# EasyEDA Pro project 游戏机v1.0.3_2026-06-08.epro

# Schematic M0底板demo
Board Name: 地猛星M0底板demo; Create Date: 2025-10-09; Page Name: P1; Project Name: M0扩展-排母; Schematic Name: M0底板demo; Update Date: 2025-10-16; Company: 嘉立创EDA; Page Size: A4; Version: V1.0
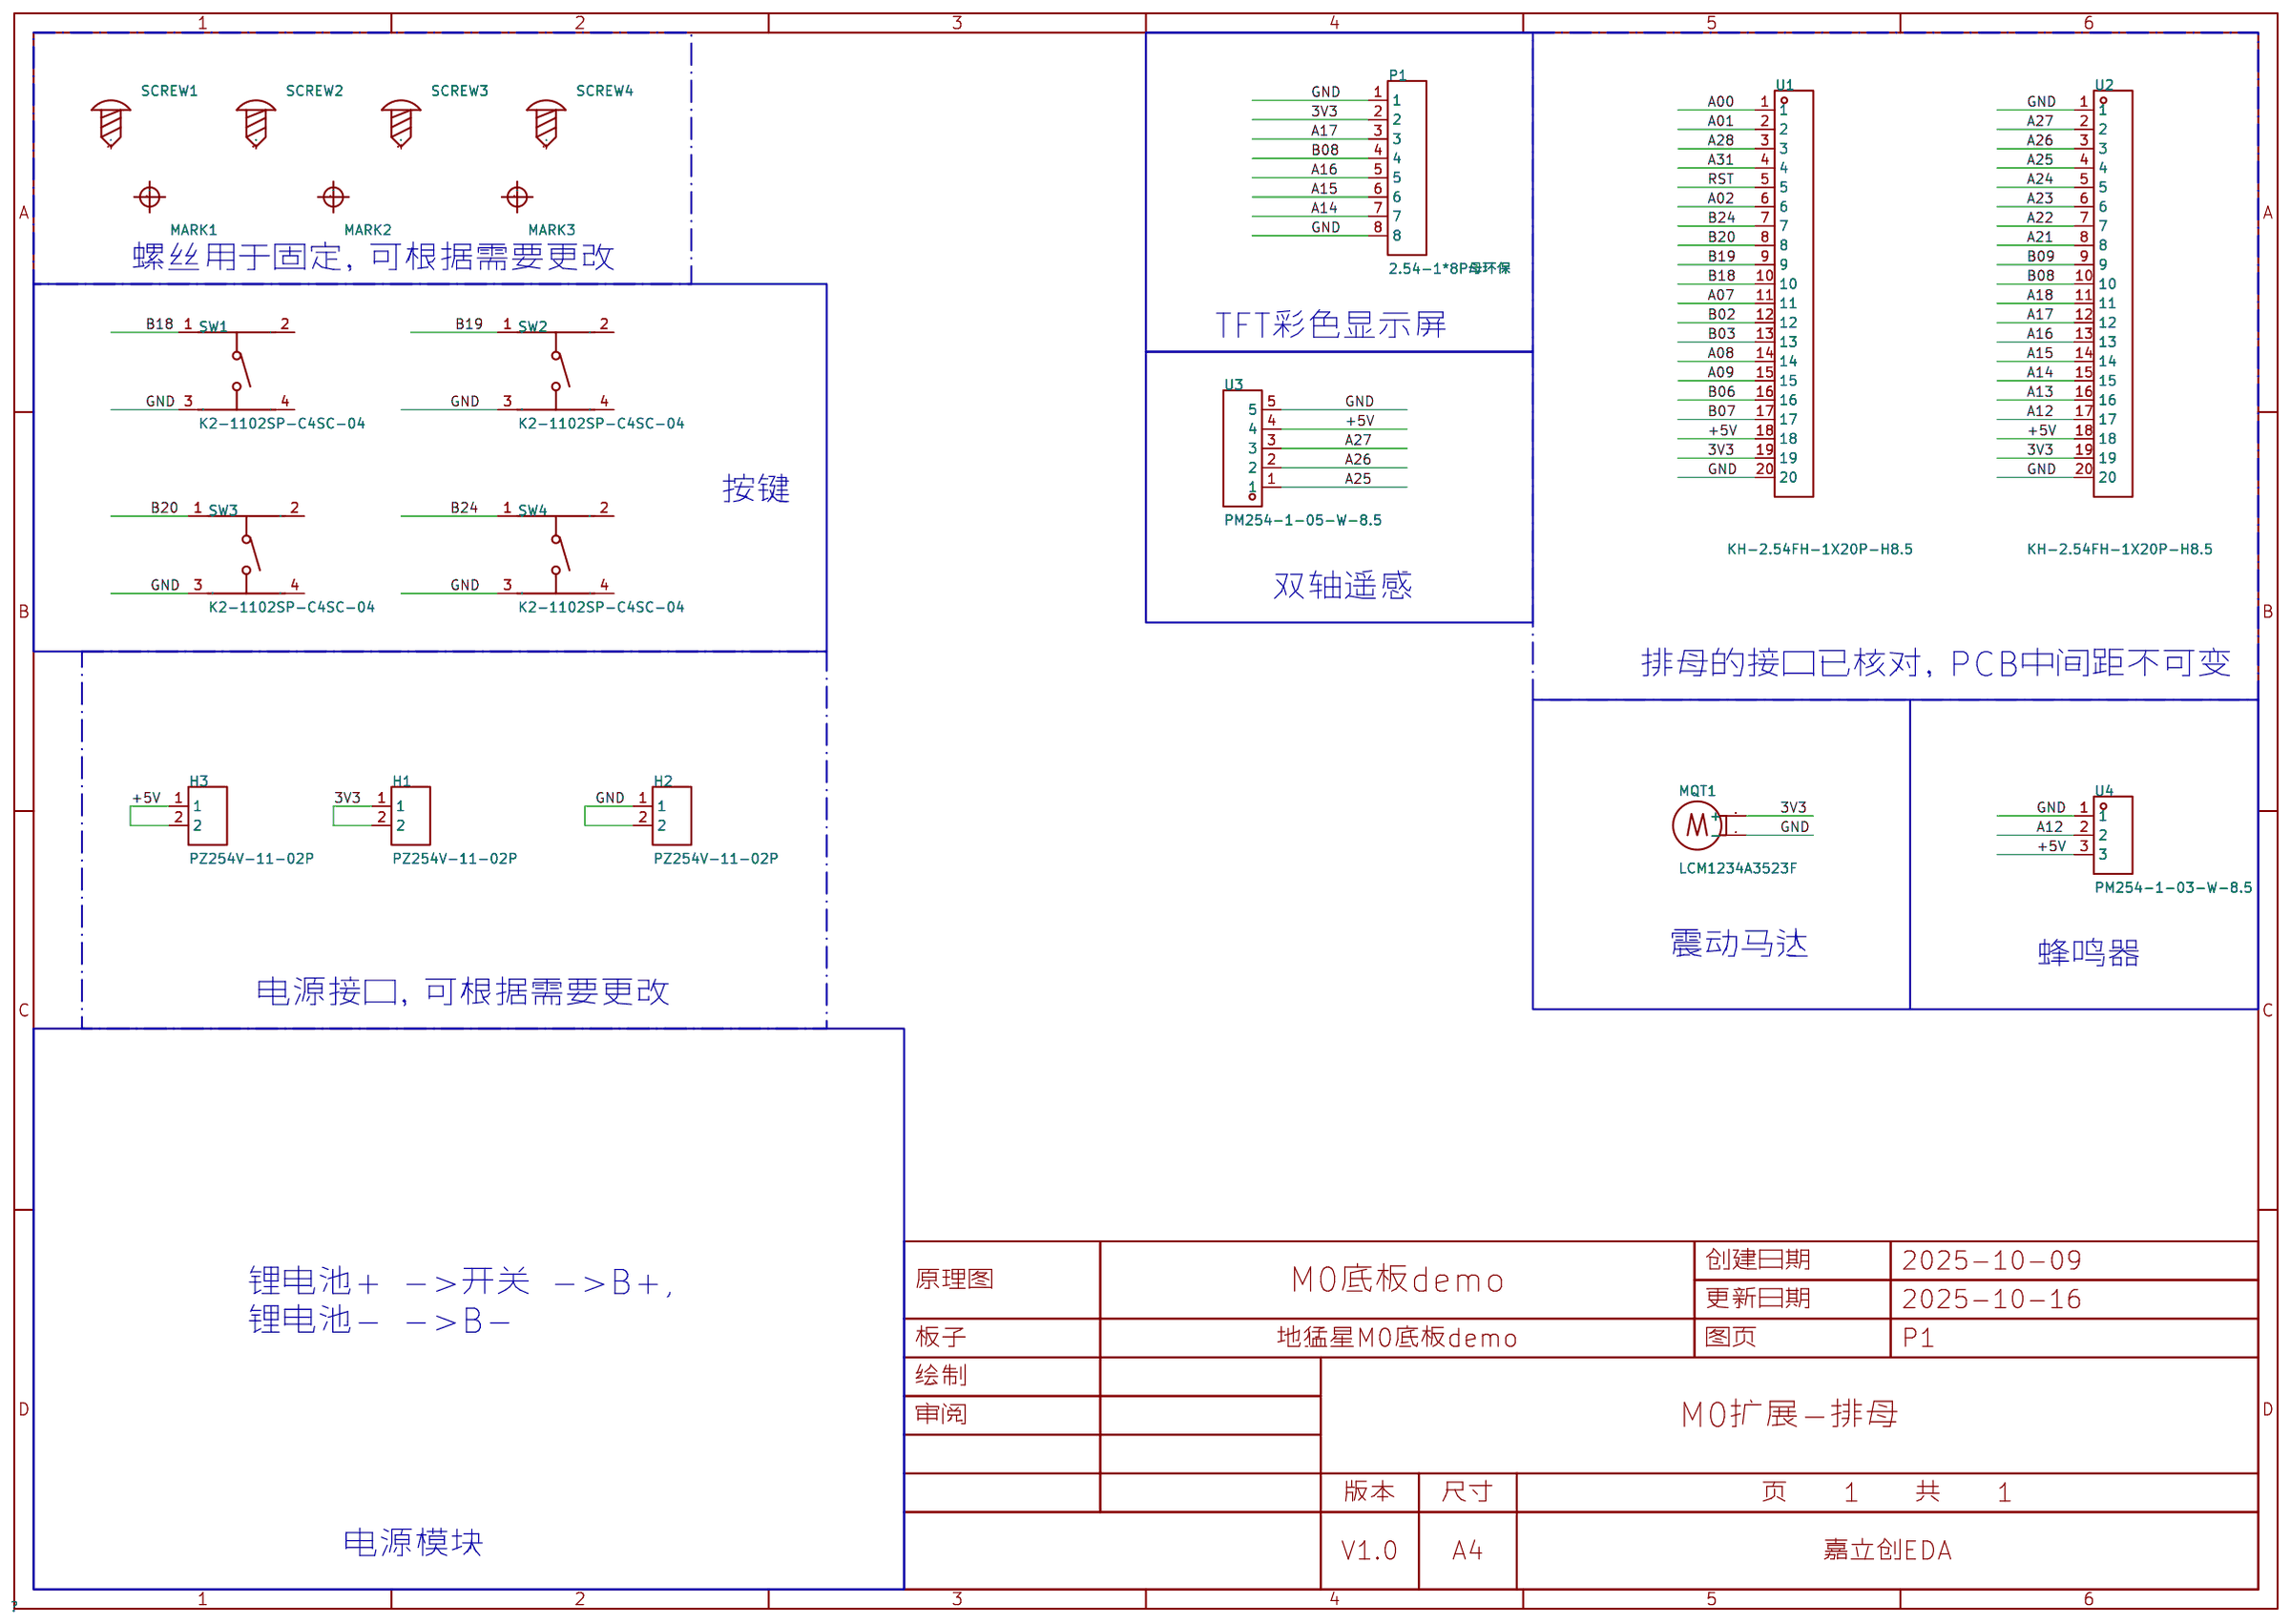
[diagram p0: schematic sheet]

## Parts
H1  PZ254V-11-02P  [HDR-TH_2P-P2.54-V-M]
H2  PZ254V-11-02P  [HDR-TH_2P-P2.54-V-M]
H3  PZ254V-11-02P  [HDR-TH_2P-P2.54-V-M]
MARK1  -  [Mark-Point-1mm]  (no BOM)
MARK2  -  [Mark-Point-1mm]  (no BOM)
MARK3  -  [Mark-Point-1mm]  (no BOM)
MQT1  LCM1234A3523F  [VIBRATING-MOTOR-SMD_WELDING]
P1  2.54-1*8P母环保  [HDR-TH_8P-P2.54-V-F]
SCREW1  -  [M3螺丝]
SCREW2  -  [M3螺丝]
SCREW3  -  [M3螺丝]
SCREW4  -  [M3螺丝]
SW1  K2-1102SP-C4SC-04  [KEY-SMD_4P-L6.0-W6.0-P4.50-LS9.5-BL]
SW2  K2-1102SP-C4SC-04  [KEY-SMD_4P-L6.0-W6.0-P4.50-LS9.5-BL]
SW3  K2-1102SP-C4SC-04  [KEY-SMD_4P-L6.0-W6.0-P4.50-LS9.5-BL]
SW4  K2-1102SP-C4SC-04  [KEY-SMD_4P-L6.0-W6.0-P4.50-LS9.5-BL]
U1  KH-2.54FH-1X20P-H8.5  [HDR-TH_20P-P2.54-V-F-2]
U2  KH-2.54FH-1X20P-H8.5  [HDR-TH_20P-P2.54-V-F-2]
U3  PM254-1-05-W-8.5  [HDR-TH_5P-P2.54-H-F-W10.0-N]
U4  PM254-1-03-W-8.5  [HDR-TH_3P-P2.54-H-F-W10.0-N]

## Library data of the parts
H1-H3 = PZ254V-11-02P: 插针结构:1x2P;间距:2.54mm;行距:-;圆针/方针:方针;安装方式:直插;排数:单排;总PIN位数:2P;额定电流:-;额定电压:-;配合针长度:6mm;塑高:2.5mm;端接针长度:3mm;触头材质:黄铜;触头镀层:-;工作温度:-40℃~+105℃;颜色:黑色;; LCSC Part Name: 1x2P 间距:2.54mm 方针 直插; Supplier Part: C492401; Manufacturer: XFCN(兴飞); Supplier Footprint: 插件,P=2.54mm; JLCPCB Part Class: 扩展库; Datasheet: https://item.szlcsc.com/datasheet/PZ254V-11-02P/502957.html; Supplier: LCSC; Pin Structure: 1x2P; Pitch: 2.54mm; Circluar Pins/Square Pins: 方针; Mounting Type: 直插; Number of Rows: 单排; Number of Pins: 2P; Length of Mating Pin: 6mm; Insulation Height: 2.5mm; Length of End Connection Pin: 3mm; Contact Material: 黄铜; Operating Temperature: -40℃~+105℃; Color: 黑色
MARK1-MARK3 = Mark-Point: Mark点
MQT1 = LCM1234A3523F: 类型:扁平振动马达;额定电压:3.7V;额定转速:11000rpm;旋转方向:CW；CCW;; LCSC Part Name: 扁平1234 高寿命马达-侧边出线款; Supplier Part: C7424783; Manufacturer: LEADER(立得); JLCPCB Part Class: Extended Part; Datasheet: https://item.szlcsc.com/datasheet/LCM1234A3523F/8412375.html; Supplier: LCSC; Type: 扁平振动马达; Voltage Rating: 3.7V; Current Rating: 100mA; Rated Speed: 11000rpm; Operating Temperature: -20℃~+70℃; Sense Of Rotation: CW；CCW; Mounting Type: 引线; Diameter (φD): 11mm
P1 = 2.54-1*8P母环保: 插孔结构:1x8P;间距:2.54mm;行距:-;圆孔/方孔:方孔;安装方式:直插;排数:单排;总孔位数:8P;额定电流:3A;插孔方向:顶部;塑高:8.5mm;触头材质:黄铜;触头镀层:金;工作温度:-55℃~+105℃;; LCSC Part Name: 1x8P 间距:2.54mm 直插; Supplier Part: C27438; Manufacturer: BOOMELE(博穆精密); Supplier Footprint: 插件,P=2.54mm; JLCPCB Part Class: Extended Part; Datasheet: https://item.szlcsc.com/datasheet/2.54-1*8P%25E6%25AF%258D%25E7%258E%25AF%25E4%25BF%259D/28187.html; Supplier: LCSC; Holes Structure: 1x8P; Pitch: 2.54mm; Circular Hole / Square Hole: 方孔; Mounting Type: 直插; Number of Rows: 单排; Number of Positions: 8P; Current Rating: 3A; Holes Direction: 顶部; Insulation Height: 8.5mm; Contact Material: 黄铜; Contact Plating: 金; Operating Temperature: -55℃~+105℃; PIN Length: 3.2mm
SCREW1-SCREW4 = M3螺丝: Supplier Footprint: 插件
SW1-SW4 = K2-1102SP-C4SC-04: 电路结构:单刀单掷;按钮形状:圆形按钮;作用力:2.5N;安装方式:立贴;开关长度:6mm;开关宽度:6mm;开关高度:5mm;触点电流:50mA;额定电压:12V;带灯:-;工作寿命:10万次;; LCSC Part Name: K2-1102SP-C4SC-04 贴片; Supplier Part: C127509; Manufacturer: 韩国韩荣; Supplier Footprint: SMD-4P,6x6mm; JLCPCB Part Class: Extended Part; Datasheet: https://item.szlcsc.com/datasheet/K2-1102SP-C4SC-04/138792.html; Supplier: LCSC; Circuit: 单刀单掷; Actuator Style: 圆形按钮; Operating Force: 2.5N; Mounting Type: 立贴; Length: 6mm; Width: 6mm; Switch Height: 5mm; Contact Current: 50mA; Voltage Rating: 12V; Life: 10万次; Operating Temperature: -25℃~+85℃
U1 U2 = KH-2.54FH-1X20P-H8.5: 插孔结构:1x20P;间距:2.54mm;行距:-;圆孔/方孔:方孔;安装方式:直插;排数:单排;总孔位数:20P;额定电流:3A;额定电压:-;插孔方向:顶部;塑高:8.5mm;工作温度:-40℃~+105℃;; LCSC Part Name: 间距:2.54mm 1x20P 直插; Supplier Part: C2905423; Manufacturer: kinghelm(金航标); Supplier Footprint: 插件,P=2.54mm; JLCPCB Part Class: 扩展库; Datasheet: https://item.szlcsc.com/datasheet/KH-2.54FH-1X20P-H8.5/3175197.html; Supplier: LCSC; Holes Structure: 1x20P; Pitch: 2.54mm; Circular Hole / Square Hole: 方孔; Mounting Type: 直插; Number of Rows: 单排; Number of Positions: 20P; Current Rating: 3A; Holes Direction: 顶部; Insulation Height: 8.5mm; Operating Temperature: -40℃~+105℃
U3 = PM254-1-05-W-8.5: 插孔结构:1x5P;间距:2.54mm;行距:-;圆孔/方孔:方孔;安装方式:弯插;排数:单排;总孔位数:5P;额定电流:3A;额定电压:-;插孔方向:侧面;塑高:8.5mm;触头材质:铜合金;工作温度:-40℃~+105℃;; LCSC Part Name: 1x5P 间距:2.54mm 弯插; Supplier Part: C2897387; Manufacturer: HCTL(华灿天禄); Supplier Footprint: 弯插,P=2.54mm; JLCPCB Part Class: Extended Part; Datasheet: https://item.szlcsc.com/datasheet/PM254-1-05-W-8.5/3142392.html; Supplier: LCSC; Holes Structure: 1x5P; Pitch: 2.54mm; Circular Hole / Square Hole: 方孔; Mounting Type: 弯插; Number of Rows: 单排; Number of Positions: 5P; Current Rating: 3A; Holes Direction: 侧面; Insulation Height: 8.5mm; Contact Material: 铜合金; Operating Temperature: -40℃~+105℃
U4 = PM254-1-03-W-8.5: 插孔结构:1x3P;间距:2.54mm;行距:-;圆孔/方孔:方孔;安装方式:弯插;排数:单排;总孔位数:3P;额定电流:3A;额定电压:-;插孔方向:侧面;塑高:8.5mm;触头材质:铜合金;工作温度:-40℃~+105℃;; LCSC Part Name: 1x3P 间距:2.54mm 弯插; Supplier Part: C2897385; Manufacturer: HCTL(华灿天禄); Supplier Footprint: 弯插,P=2.54mm; JLCPCB Part Class: Extended Part; Datasheet: https://item.szlcsc.com/datasheet/PM254-1-03-W-8.5/3142390.html; Supplier: LCSC; Holes Structure: 1x3P; Pitch: 2.54mm; Circular Hole / Square Hole: 方孔; Mounting Type: 弯插; Number of Rows: 单排; Number of Positions: 3P; Current Rating: 3A; Holes Direction: 侧面; Insulation Height: 8.5mm; Contact Material: 铜合金; Operating Temperature: -40℃~+105℃

## Nets
3V3: H1.1 H1.2 MQT1.2(+) P1.2 U1.19 U2.19
+5V: H3.1 H3.2 U1.18 U2.18 U3.4 U4.3
GND: H2.1 H2.2 MQT1.1(-) P1.1 P1.8 SW1.3 SW2.3 SW3.3 SW4.3 U1.20 U2.1 U2.20 U3.5 U4.1
A00: U1.1
A01: U1.2
A02: U1.6
A07: U1.11
A08: U1.14
A09: U1.15
A12: U2.17 U4.2
A13: U2.16
A14: P1.7 U2.15
A15: P1.6 U2.14
A16: P1.5 U2.13
A17: P1.3 U2.12
A18: U2.11
A21: U2.8
A22: U2.7
A23: U2.6
A24: U2.5
A25: U2.4 U3.1
A26: U2.3 U3.2
A27: U2.2 U3.3
A28: U1.3
A31: U1.4
B02: U1.12
B03: U1.13
B06: U1.16
B07: U1.17
B08: P1.4 U2.10
B09: U2.9
B18: SW1.1 U1.10
B19: SW2.1 U1.9
B20: SW3.1 U1.8
B24: SW4.1 U1.7
RST: U1.5

Not connected (* = marked no-connect by the designer): MARK1 1; MARK2 1; MARK3 1; SCREW1 1; SCREW2 1; SCREW3 1; SCREW4 1; SW1 2 4; SW2 2 4; SW3 2 4; SW4 2 4

## Notes on the sheet
- 螺丝用于固定，可根据需要更改
- TFT彩色显示屏
- 按键
- 双轴遥感
- 排母的接口已核对，PCB中间距不可变
- 震动马达
- 蜂鸣器
- 电源接口，可根据需要更改
- 锂电池+ ->开关 ->B+,
  锂电池- ->B-
- 电源模块

# Board PCB1
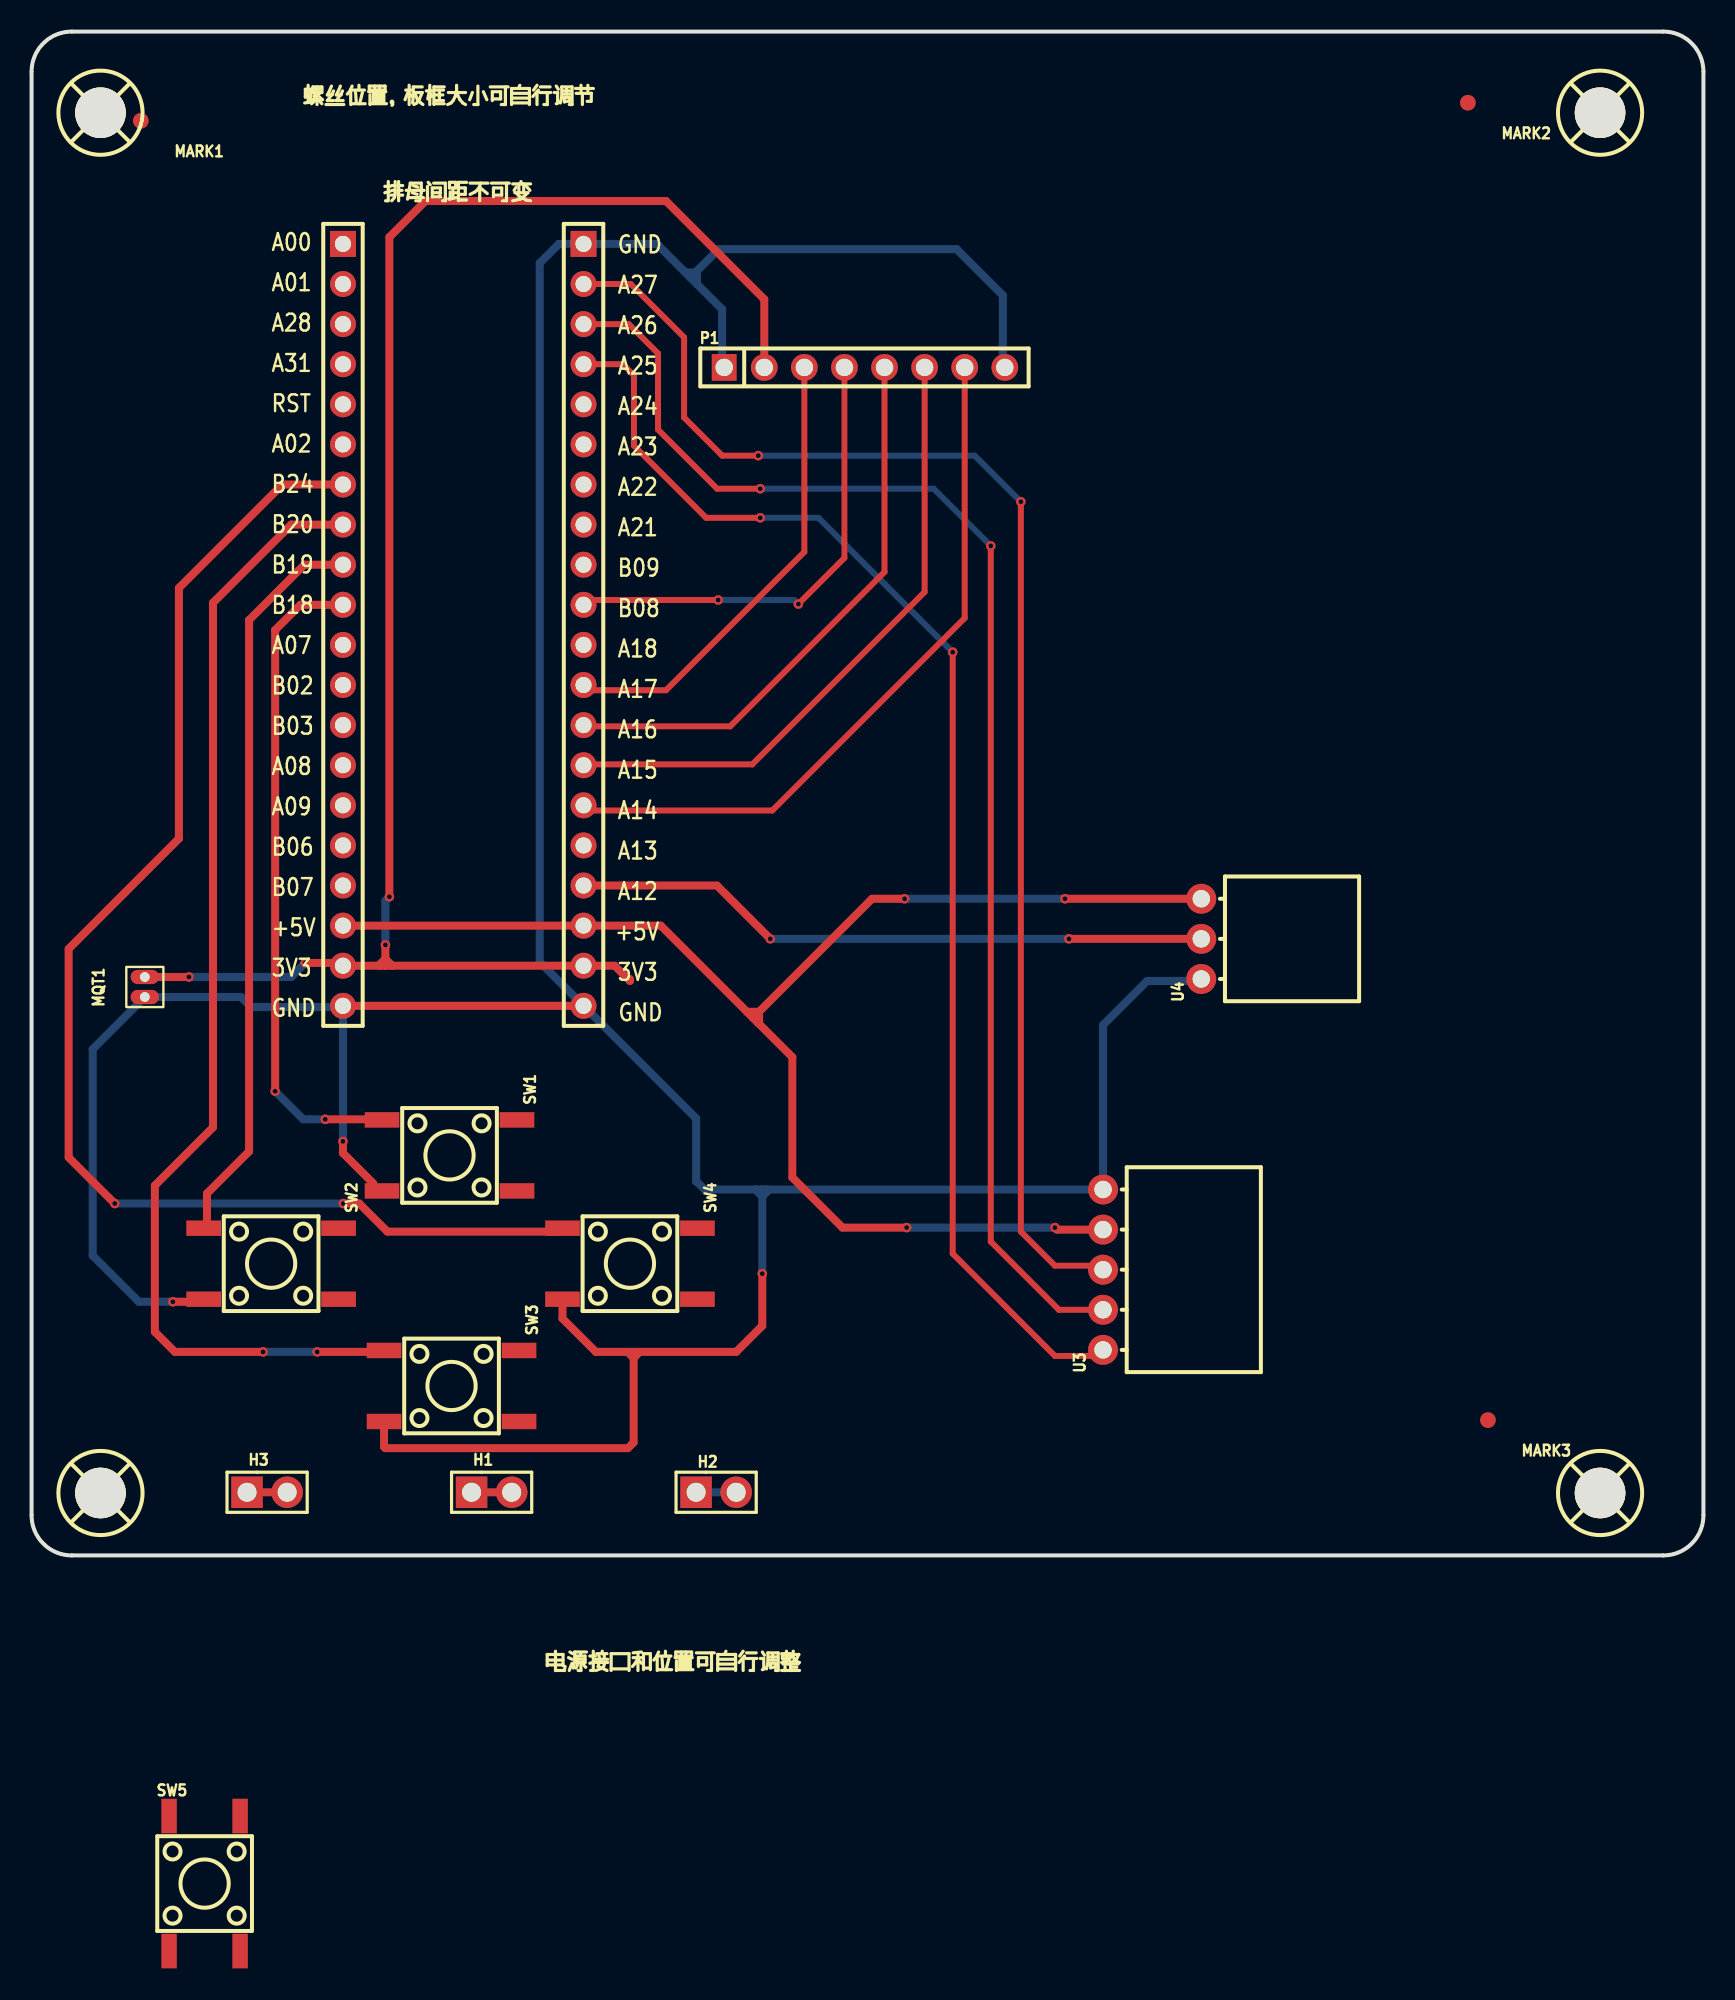
[diagram p1: board, top side]
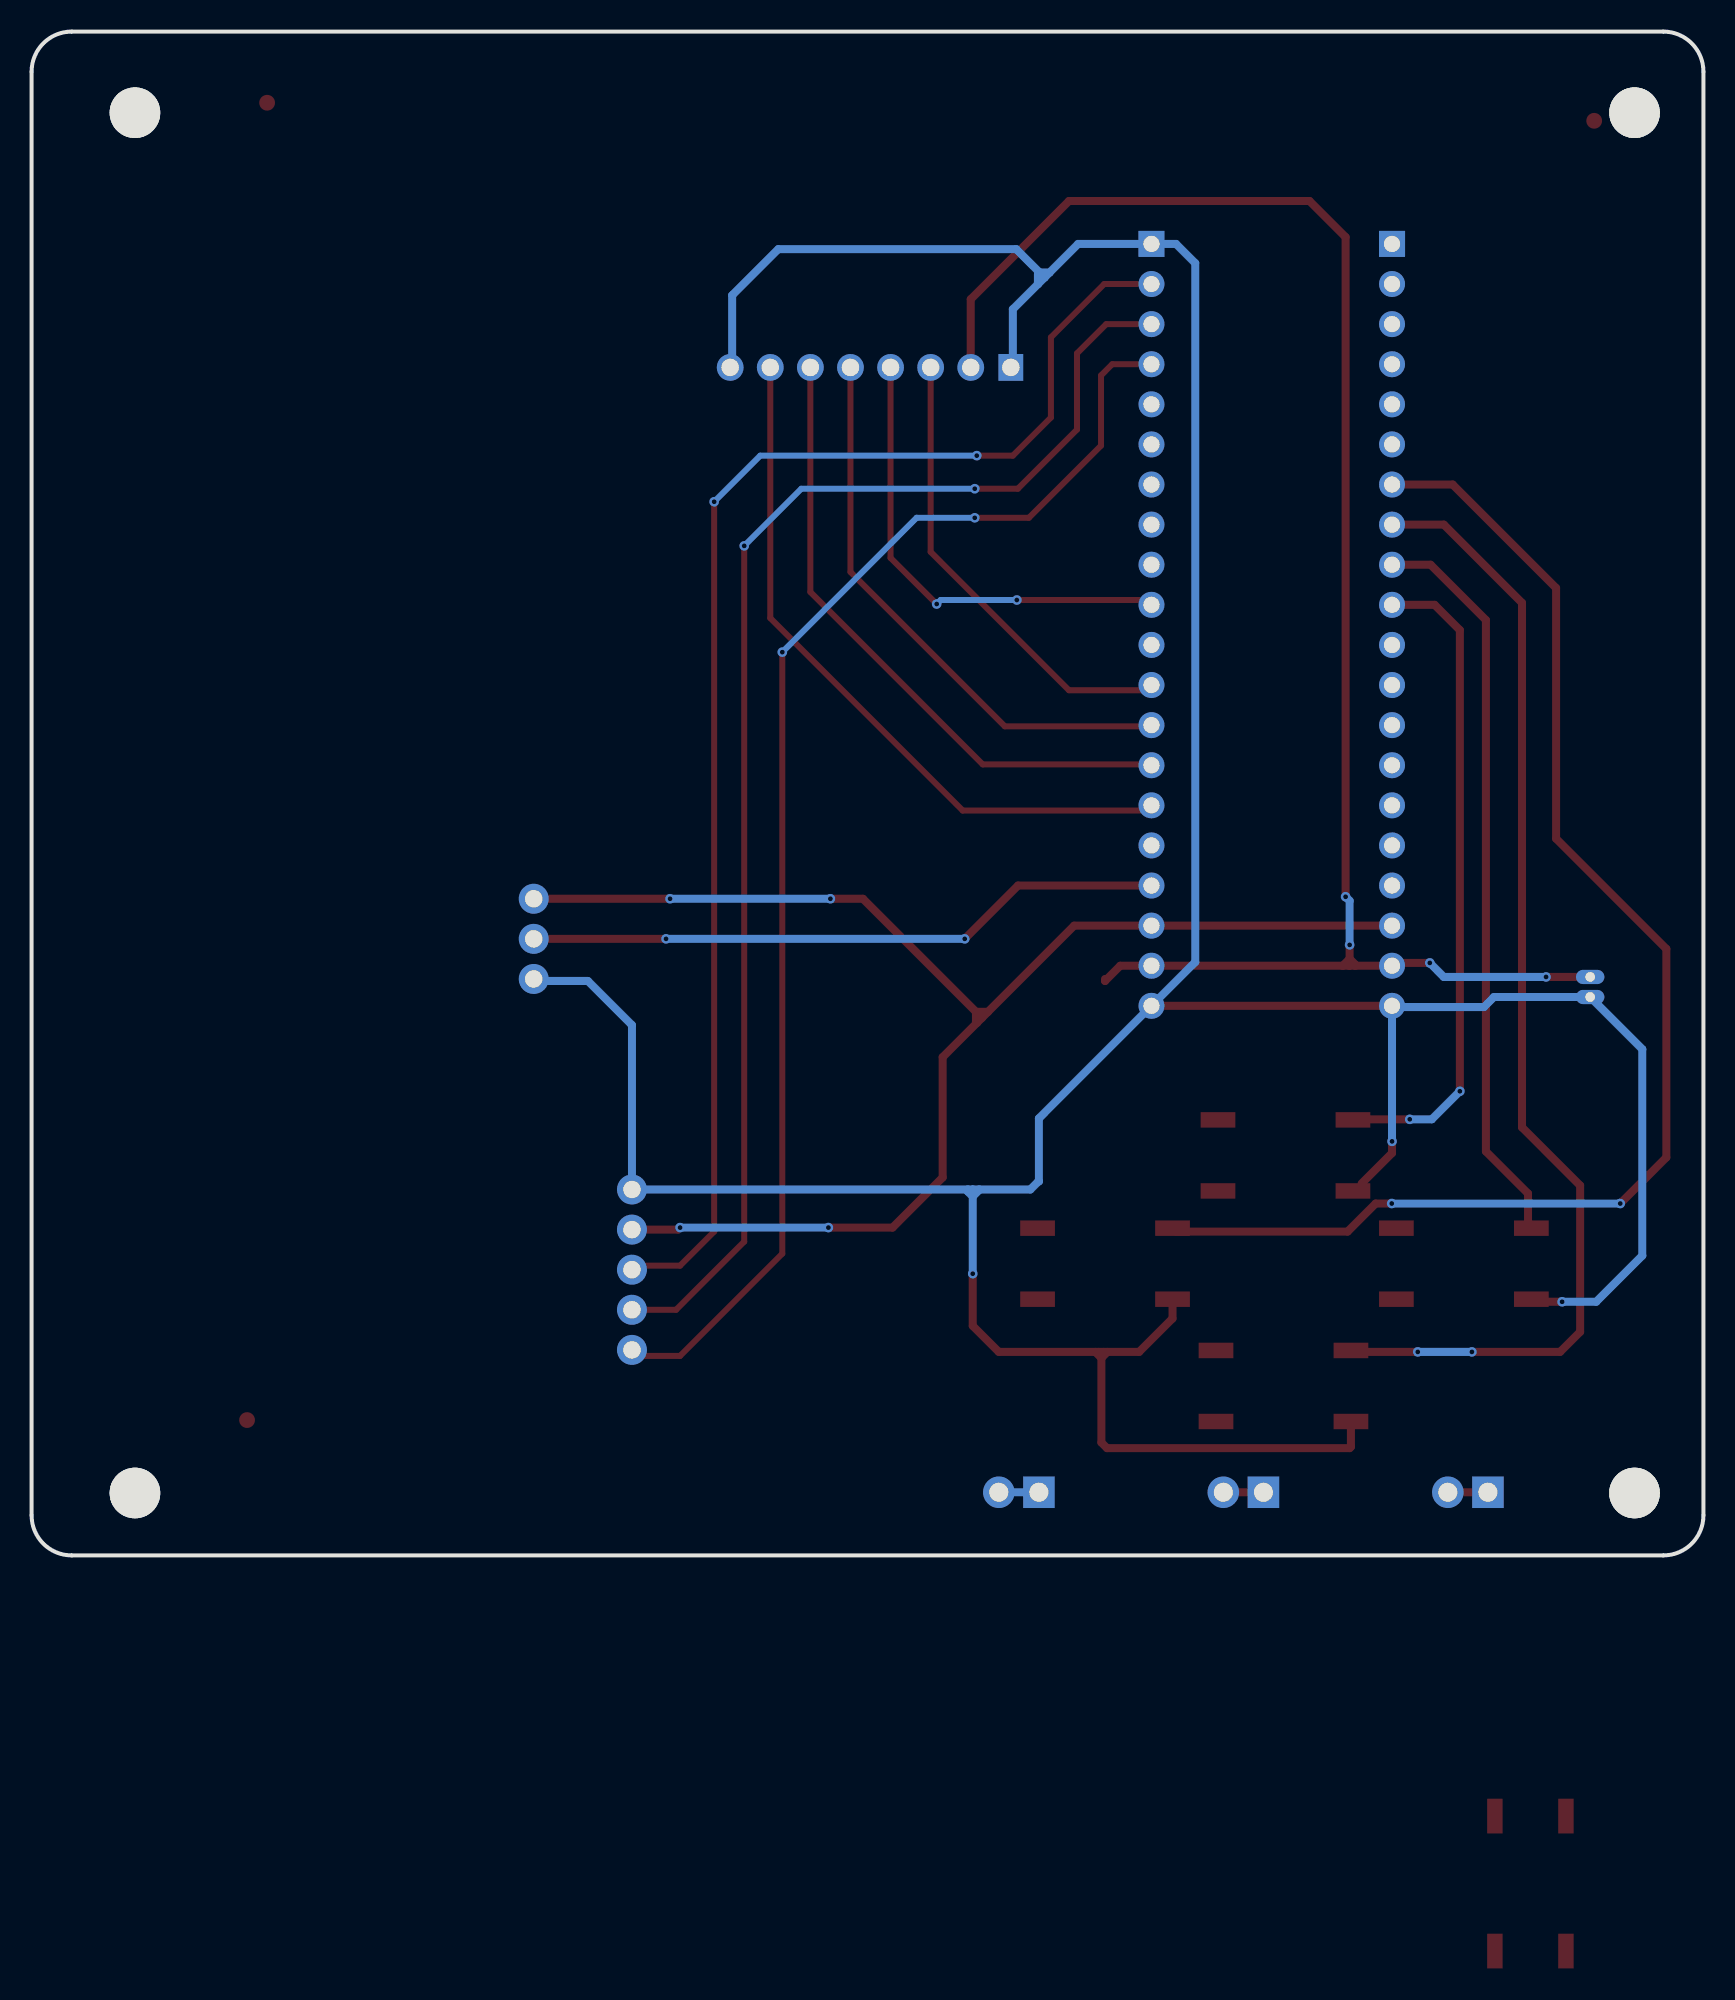
[diagram p2: board, bottom side, seen from below]

Outline 105.92 x 96.52 mm; copper layers: Top Layer, Bottom Layer. Coordinates in mm from the lower left corner of the outline.
Outline path: 0,93.98 arc(0.74,95.78) 2.54,96.52 103.38,96.52 arc(105.17,95.78) 105.92,93.98 105.92,2.54 arc(105.17,0.74) 103.38,0 2.54,0 arc(0.74,0.74) 0,2.54 0,93.98
Stack: Top Layer 0.035mm / Dielectric1 1.51mm FR4 er 4.5 / Bottom Layer 0.035mm

## Design rules (mm)
spacing copperThickness1oz (default): track to track 0.102, other pairs 0.152 to 0.3
spacing copperThickness2oz: track to track 0.203, other pairs 0.152 to 0.3
spacing Plane_innerPlane: track to track 0.102, other pairs 0.152 to 0.3
spacing Copper_copperRegion: track to track 0.102, other pairs 0.152 to 0.3
track width copperThickness1oz (default): min 0.127, default 0.254, max 2.54
track width copperThickness2oz: min 0.203, default 0.254, max 2.54
differential pair differentialPair (default): width min 0.127, default 0.254, max 2.54; gap min 0.152, default 0.152

## Placement (name value [footprint] x y rotation side)
H1  PZ254V-11-02P  [HDR-TH_2P-P2.54-V-M]  29.15 4 0 top
H2  PZ254V-11-02P  [HDR-TH_2P-P2.54-V-M]  43.37 4 0 top
H3  PZ254V-11-02P  [HDR-TH_2P-P2.54-V-M]  14.92 4 0 top
MARK1  -  [Mark-Point-1mm]  9.46 90.87 0 top
MARK2  -  [Mark-Point-1mm]  93.54 92.01 0 top
MARK3  -  [Mark-Point-1mm]  94.81 8.57 0 top
MQT1  LCM1234A3523F  [VIBRATING-MOTOR-SMD_WELDING]  7.18 36 90 top
P1  2.54-1*8P母环保  [HDR-TH_8P-P2.54-V-F]  52.77 75.25 0 top
SCREW1  -  [M3螺丝]  4.37 91.38 0 top
SCREW2  -  [M3螺丝]  99.37 91.38 0 top
SCREW3  -  [M3螺丝]  4.37 3.95 0 top
SCREW4  -  [M3螺丝]  99.37 3.95 0 top
SW1  K2-1102SP-C4SC-04  [KEY-SMD_4P-L6.0-W6.0-P4.50-LS9.5-BL]  26.48 25.34 270 top
SW2  K2-1102SP-C4SC-04  [KEY-SMD_4P-L6.0-W6.0-P4.50-LS9.5-BL]  15.18 18.48 270 top
SW3  K2-1102SP-C4SC-04  [KEY-SMD_4P-L6.0-W6.0-P4.50-LS9.5-BL]  26.61 10.73 270 top
SW4  K2-1102SP-C4SC-04  [KEY-SMD_4P-L6.0-W6.0-P4.50-LS9.5-BL]  37.91 18.48 270 top
SW5  K2-1102SP-C4SC-04  [KEY-SMD_4P-L6.0-W6.0-P4.50-LS9.5-BL]  10.96 -20.79 0 top
U1  KH-2.54FH-1X20P-H8.5  [HDR-TH_20P-P2.54-V-F-2]  19.73 58.94 270 top
U2  KH-2.54FH-1X20P-H8.5  [HDR-TH_20P-P2.54-V-F-2]  34.97 58.94 270 top
U3  PM254-1-05-W-8.5  [HDR-TH_5P-P2.54-H-F-W10.0-N]  67.88 18.1 90 top
U4  PM254-1-03-W-8.5  [HDR-TH_3P-P2.54-H-F-W10.0-N]  74.1 39.05 90 top

## Footprints (pads in the part's own frame, mm; a bottom-side part is the same pattern mirrored in y, then rotated)
HDR-TH_2P-P2.54-V-M
  rect 2x2 hole 1.2: 1(-1.27,0)
  round 2 hole 1.2: 2(1.27,0)
HDR-TH_3P-P2.54-H-F-W10.0-N
  round 1.9 hole 1.1: 1(-2.54,0) 2(0,0) 3(2.54,0)
HDR-TH_5P-P2.54-H-F-W10.0-N
  round 1.9 hole 1.1: 1(-5.08,0) 2(-2.54,0) 3(0,0) 4(2.54,0) 5(5.08,0)
HDR-TH_8P-P2.54-V-F
  rect 1.575x1.7 hole 1.1: 1(-8.89,0)
  round 1.7 hole 1.1: 2(-6.35,0) 3(-3.81,0) 4(-1.27,0) 5(1.27,0) 6(3.81,0) 7(6.35,0) 8(8.89,0)
HDR-TH_20P-P2.54-V-F-2
  rect 1.65x1.65 hole 1.02: 1(-24.13,0)
  round 1.65 hole 1.02: 2(-21.59,0) 3(-19.05,0) 4(-16.51,0) 5(-13.97,0) 6(-11.43,0) 7(-8.89,0) 8(-6.35,0) 9(-3.81,0) 10(-1.27,0) 11(1.27,0) 12(3.81,0) 13(6.35,0) 14(8.89,0) 15(11.43,0) 16(13.97,0) 17(16.51,0) 18(19.05,0) 19(21.59,0) 20(24.13,0)
KEY-SMD_4P-L6.0-W6.0-P4.50-LS9.5-BL
  rect 0.98x2.2 smd: 1(-2.25,-4.275) 2(-2.25,4.275) 3(2.25,-4.275) 4(2.25,4.275)
M3螺丝
  round 3.2 hole 3.2: 1(0,0)
Mark-Point-1mm
  round 1 smd: 1(-2.54,0)
VIBRATING-MOTOR-SMD_WELDING
  oval 0.9x1.8 hole 0.61: 1(-0.635,0) 2(0.635,0)

## Nets
As in the schematic, except:
+5V: H3.1 H3.2 SW5.3 U1.18 U2.18 U3.4 U4.3

Pads without a net: MARK1 1; MARK2 1; MARK3 1; SCREW1 1; SCREW2 1; SCREW3 1; SCREW4 1; SW1 2 4; SW2 2 4; SW3 2 4; SW4 2 4; SW5 2 4

## Via types
v1: diameter 0.61, hole 0.305, Top Layer to Bottom Layer, 27 vias

## Routing (per net, layer and track width the routed paths; a pad name or vN(x,y) marks a point on that pad's centre or on a via; arc(x,y) is an arc through that point)
3V3: length 113.3
  Top Layer w0.508: 22.06,37.35 U1.19 19.55,37.53 v1(17.34,37.53) ; 22.06,37.35 22.43,37.35 ; 22.06,37.35 22.06,37.43 22.42,37.79 ; 22.43,37.35 22.85,37.35 ; 22.43,37.35 22.42,37.37 22.42,37.79 ; 22.85,37.35 22.42,37.79 ; 22.85,37.35 U2.19 36.94,37.35 37.91,36.39 37.91,36.51 ; 22.42,37.79 v1(22.42,38.67) ; P1.2 46.42,79.57 40.2,85.79 24.96,85.79 22.67,83.5 v1(22.67,41.72) ; H1.2 H1.1 ; MQT1.2 v1(9.97,36.64)
  Bottom Layer w0.508: v1(17.34,37.53) 16.45,36.64 v1(9.97,36.64) ; v1(22.67,41.72) 22.42,41.47 v1(22.42,38.67)
+5V: length 96.1
  Top Layer w0.508: v1(64.83,20.76) 64.96,20.64 U3.4 ; 45.71,34.05 46.02,33.73 ; 45.71,34.05 46.09,34.43 ; 45.71,34.05 39.87,39.89 U2.18 U1.18 ; 46.02,33.73 46.09,33.8 46.09,34.43 ; 46.02,33.73 48.2,31.56 48.2,23.94 51.37,20.76 v1(55.44,20.76) ; 46.09,34.43 45.33,34.43 ; 46.09,34.43 53.25,41.59 v1(55.31,41.59) ; H3.2 H3.1 ; v1(65.47,41.59) U4.3
  Bottom Layer w0.508: v1(55.31,41.59) v1(65.47,41.59) ; v1(55.44,20.76) v1(64.83,20.76)
GND: length 270.1
  Top Layer w0.508: 38.53,12.89 44.64,12.89 46.29,14.54 v1(46.29,17.84) ; 38.53,12.89 38.31,12.89 ; 38.53,12.89 38.14,12.51 ; SW4.3 33.63,15.01 35.75,12.89 37.76,12.89 ; v1(19.73,26.23) 19.73,25.48 21.65,23.56 ; 38.14,12.72 38.14,12.75 38.01,12.89 ; 38.14,12.72 38.31,12.89 ; 38.14,12.72 38.14,12.51 ; 38.01,12.89 37.76,12.89 ; 38.01,12.89 38.31,12.89 ; 38.14,12.51 37.76,12.89 ; 38.14,12.51 38.14,7.15 37.78,6.79 22.42,6.79 22.33,6.88 SW3.3 ; SW2.3 10.74,16.07 v1(8.95,16.07) ; U1.20 U2.20
  Bottom Layer w0.508: 45.88,23.18 42.64,23.18 42.13,23.69 42.1,23.69 42.1,27.68 U2.20 32.19,37.58 32.19,81.85 33.41,83.07 U2.1 39.61,83.07 41.42,81.26 ; 45.88,23.18 46.28,23.18 ; 45.88,23.18 45.88,23.15 46.29,22.74 ; 46.61,23.18 U3.5 67.88,33.59 70.68,36.39 73.98,36.39 74.1,36.51 ; 46.61,23.18 46.28,23.18 ; 46.61,23.18 46.61,23.05 46.29,22.74 ; 42.06,81.26 41.42,81.26 ; 42.06,81.26 43.54,82.74 58.61,82.74 61.53,79.82 61.53,75.37 P1.8 ; 42.06,81.26 41.74,80.94 ; 42.06,81.26 42.16,81.16 42.16,80.52 ; 41.42,81.26 41.74,80.94 ; 46.28,23.18 46.29,23.17 46.29,22.74 ; 42.16,80.52 41.74,80.94 ; 42.16,80.52 43.75,78.93 43.75,75.37 P1.1 ; 46.29,22.74 v1(46.29,17.84) ; H2.1 H2.2 ; v1(8.95,16.07) 6.79,16.07 3.87,18.99 3.87,32.07 MQT1.1 13.27,35.37 13.91,34.73 19.65,34.73 U1.20 v1(19.73,26.23)
A12: length 40.5
  Top Layer w0.508: v1(65.72,39.05) U4.2 ; U2.17 43.42,42.43 v1(46.8,39.05)
  Bottom Layer w0.508: v1(46.8,39.05) v1(65.72,39.05)
A14: length 45.2
  Top Layer w0.381: P1.7 59.12,59.37 46.93,47.18 35.3,47.18 U2.15
A15: length 40.4
  Top Layer w0.381: P1.6 56.58,61.02 45.66,50.1 35.02,50.1 U2.14
A16: length 36.1
  Top Layer w0.381: P1.5 54.04,62.29 44.26,52.51 35.04,52.51 U2.13
A17: length 29.4
  Top Layer w0.381: P1.3 48.96,63.56 40.2,54.8 35.3,54.8 U2.12
A25: length 84
  Top Layer w0.381: v1(58.36,57.21) 58.36,19.11 64.83,12.64 67.5,12.64 U3.1 ; U2.4 37.45,75.45 38.16,74.74 38.16,70.29 42.74,65.72 v1(46.16,65.72)
  Bottom Layer w0.381: v1(58.36,57.21) 49.85,65.72 v1(46.16,65.72)
A26: length 87.4
  Top Layer w0.381: v1(46.16,67.56) 43.43,67.56 39.69,71.31 39.69,76.14 37.83,77.99 U2.3 ; v1(60.77,63.94) 60.77,19.88 65.09,15.56 U3.2
  Bottom Layer w0.381: v1(60.77,63.94) 57.15,67.56 v1(46.16,67.56)
A27: length 88.8
  Top Layer w0.381: v1(46.04,69.66) 43.75,69.66 41.34,72.07 41.34,77.15 37.96,80.53 U2.2 ; v1(62.67,66.74) 62.67,20.51 64.83,18.35 67.63,18.35 U3.3
  Bottom Layer w0.381: v1(62.67,66.74) 59.75,69.66 v1(46.04,69.66)
B08: length 30
  Top Layer w0.381: U2.10 35.27,60.52 v1(43.5,60.52) ; P1.4 51.5,63.18 v1(48.58,60.26)
  Bottom Layer w0.381: v1(43.5,60.52) 48.32,60.52 v1(48.58,60.26)
B18: length 41.7
  Top Layer w0.508: v1(15.43,29.4) 15.43,58.61 17.03,60.21 U1.10 ; SW1.1 22.17,27.62 v1(18.61,27.62)
  Bottom Layer w0.508: v1(15.43,29.4) 17.21,27.62 v1(18.61,27.62)
B19: length 47.1
  Top Layer w0.508: SW2.1 11.11,20.94 11.11,22.92 13.78,25.59 13.78,59.25 17.28,62.75 U1.9
B20: length 73.1
  Top Layer w0.508: v1(18.1,12.89) 22.24,12.89 SW3.1 ; v1(14.67,12.89) 9.08,12.89 7.81,14.16 7.81,23.43 11.49,27.11 11.49,60.34 16.45,65.29 U1.8
  Bottom Layer w0.508: v1(14.67,12.89) v1(18.1,12.89)
B24: length 85.4
  Top Layer w0.508: v1(5.27,22.29) 2.35,25.21 2.35,38.42 9.33,45.4 9.33,61.28 15.89,67.83 U1.7 ; SW4.1 33.42,20.51 22.54,20.51 20.76,22.29 v1(19.75,22.29)
  Bottom Layer w0.508: v1(5.27,22.29) v1(19.75,22.29)

## Text on the board
Top Silkscreen Layer: A00 | A01 | A28 | A31 | RST | A02 | B24 | B20 | B19 | B18 | A07 | B02 | B03 | A08 | A09 | B06 | B07 | +5V | 3V3 | GND | A27 | A26 | A25 | A24 | A23 | A22 | A21 | B09 | B08 | A18 | A17 | A16 | A15 | A14 | A13 | A12 | 螺丝位置，板框大小可自行调节 | 排母间距不可变 | 电源接口和位置可自行调整
